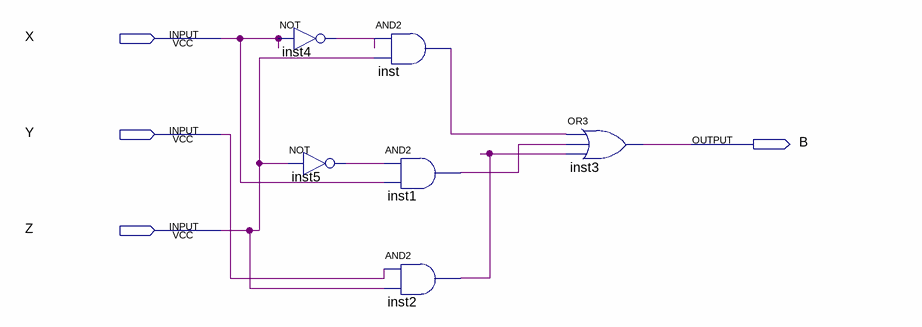
[diagram p0: schematic sheet]
// Quartus schematic Circuito-B.bdf as structural Verilog: 6 symbols, 4 pins
module \Circuito-B  (
  input  X,
  input  Y,
  input  Z,
  output B
);

  wire inst1_out, inst2_out, inst4_out, inst5_out, inst_out;

  not inst4 (inst4_out, X);
  not inst5 (inst5_out, Z);
  and inst (inst_out, inst4_out, Z);
  and inst1 (inst1_out, inst5_out, X);
  and inst2 (inst2_out, Y, Z);
  or inst3 (B, inst_out, inst1_out, inst2_out);
endmodule
